# EAGLE schematic DIP-HDMI-v1.0 (EAGLE 7.6.0)

## Sheet 1 of 3
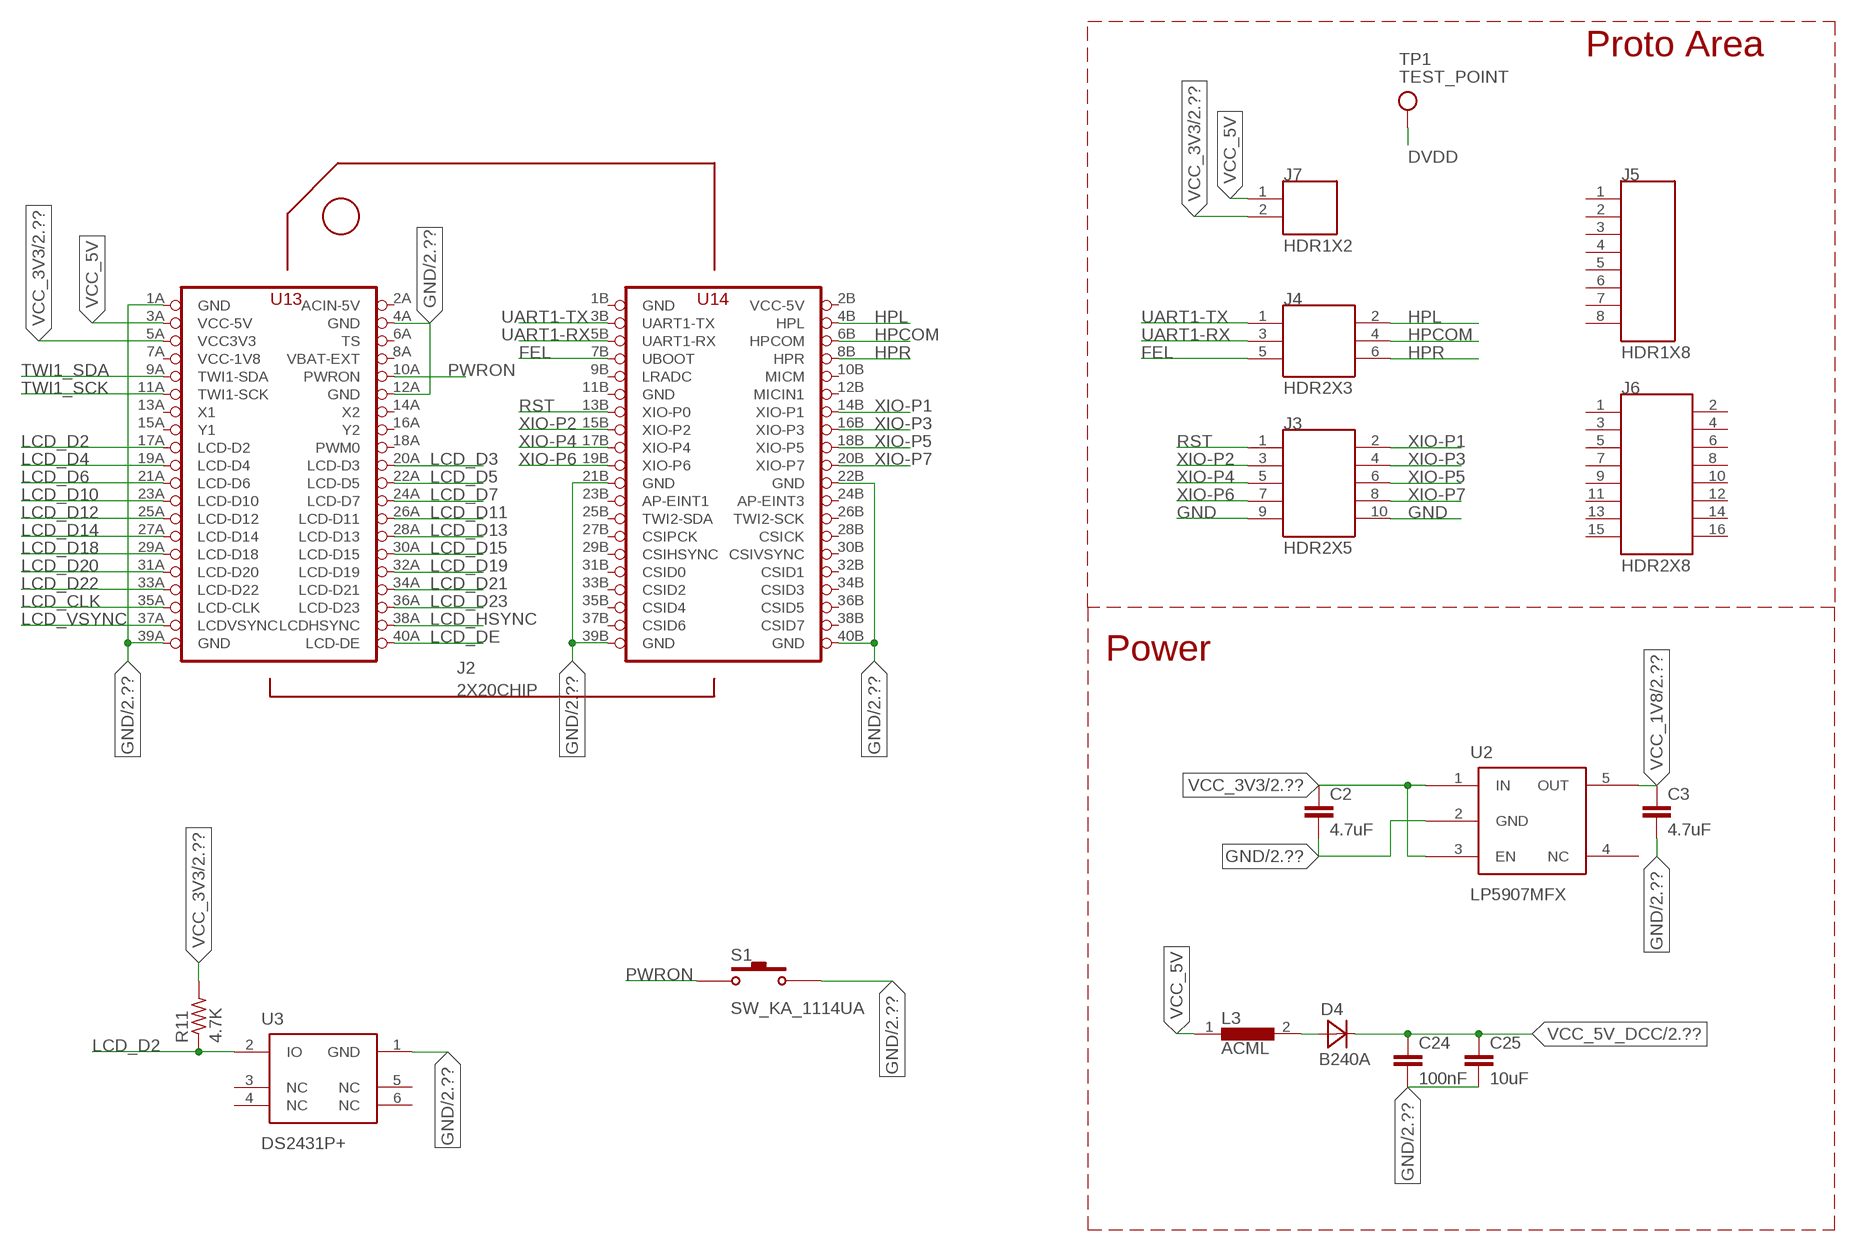
[diagram p0: schematic, sheet 1]

### Parts
C2  4.7uF  CAPACITOR  [1608_0603]
C3  4.7uF  CAPACITOR  [1608_0603]
C24  100nF  CAPACITOR  [1608_0603]
C25  10uF  CAPACITOR  [1608_0603]
D4  B240A  [SMA]
J2  2X20CHIP  [HDR2X2X20H]
J3  HDR2X5  [HDR2X5]
J4  HDR2X3  [HDR2X3]
J5  HDR1X8  [HDR1X8]
J6  HDR2X8  [HDR2X8]
J7  HDR1X2  [HDR1X2]
L3  ACML  [0603]
R11  4.7K  RESISTOR  [J1-0603]
S1  SW_KA_1114UA  [SW_KA_1114UA]
TP1  TEST_POINT  [TP-1MMX1MM]
U2  LP5907MFX  [SOT23-5]
U3  DS2431P+  [DS2431P+T&R]

### Nets
DVDD: TP1.0 ; also sheet 2
FEL: J2.7B(UBOOT) J4.5
GND: C2.2 C3.2 C24.2 C25.2 J2.1A(GND) J2.4A(GND) J2.12A(GND) J2.21B(GND) J2.22B(GND) J2.39A(GND) J2.39B(GND) J2.40B(GND) J3.9 J3.10 S1.3 S1.4 U2.2(GND) U3.1(GND) ; also sheet 2,3
HPCOM: J2.6B(HPCOM) J4.4
HPL: J2.4B(HPL) J4.2
HPR: J2.8B(HPR) J4.6
LCD_CLK: J2.35A(LCD-CLK) ; also sheet 2
LCD_D2: J2.17A(LCD-D2) R11.1 U3.2(IO)
LCD_D3: J2.20A(LCD-D3) ; also sheet 2
LCD_D4: J2.19A(LCD-D4) ; also sheet 2
LCD_D5: J2.22A(LCD-D5) ; also sheet 2
LCD_D6: J2.21A(LCD-D6) ; also sheet 2
LCD_D7: J2.24A(LCD-D7) ; also sheet 2
LCD_D10: J2.23A(LCD-D10) ; also sheet 2
LCD_D11: J2.26A(LCD-D11) ; also sheet 2
LCD_D12: J2.25A(LCD-D12) ; also sheet 2
LCD_D13: J2.28A(LCD-D13) ; also sheet 2
LCD_D14: J2.27A(LCD-D14) ; also sheet 2
LCD_D15: J2.30A(LCD-D15) ; also sheet 2
LCD_D18: J2.29A(LCD-D18) ; also sheet 2
LCD_D19: J2.32A(LCD-D19) ; also sheet 2
LCD_D20: J2.31A(LCD-D20) ; also sheet 2
LCD_D21: J2.34A(LCD-D21) ; also sheet 2
LCD_D22: J2.33A(LCD-D22) ; also sheet 2
LCD_D23: J2.36A(LCD-D23) ; also sheet 2
LCD_DE: J2.40A(LCD-DE) ; also sheet 2
LCD_HSYNC: J2.38A(LCDHSYNC) ; also sheet 2
LCD_VSYNC: J2.37A(LCDVSYNC) ; also sheet 2
N$7: D4.1(A) L3.2
PWRON: J2.10A(PWRON) S1.1 S1.2
RST: J2.13B(XIO-P0) J3.1 ; also sheet 2
TWI1_SCK: J2.11A(TWI1-SCK) ; also sheet 2,3
TWI1_SDA: J2.9A(TWI1-SDA) ; also sheet 2,3
UART1-RX: J2.5B(UART1-RX) J4.3
UART1-TX: J2.3B(UART1-TX) J4.1
VCC_1V8: C3.1 U2.5(OUT) ; also sheet 2
VCC_3V3: C2.1 J2.5A(VCC3V3) J7.2 R11.2 U2.1(IN) U2.3(EN) ; also sheet 2
VCC_5V: J2.3A(VCC-5V) J7.1 L3.1
VCC_5V_DCC: C24.1 C25.1 D4.2(C) ; also sheet 2,3
XIO-P1: J2.14B(XIO-P1) J3.2
XIO-P2: J2.15B(XIO-P2) J3.3
XIO-P3: J2.16B(XIO-P3) J3.4
XIO-P4: J2.17B(XIO-P4) J3.5
XIO-P5: J2.18B(XIO-P5) J3.6
XIO-P6: J2.19B(XIO-P6) J3.7
XIO-P7: J2.20B(XIO-P7) J3.8
Unconnected: J2.2A(ACIN-5V) J2.6A(TS) J2.8A(VBAT-EXT) J2.9B(LRADC) J2.10B(MICM) J2.12B(MICIN1) J2.13A(X1) J2.14A(X2) J2.15A(Y1) J2.16A(Y2) J2.18A(PWM0) J2.23B(AP-EINT1) J2.24B(AP-EINT3) J2.25B(TWI2-SDA) J2.26B(TWI2-SCK) J2.27B(CSIPCK) J2.28B(CSICK) J2.29B(CSIHSYNC) J2.30B(CSIVSYNC) J2.31B(CSID0) J2.32B(CSID1) J2.33B(CSID2) J2.34B(CSID3) J2.35B(CSID4) J2.36B(CSID5) J2.37B(CSID6) J2.38B(CSID7) J5.1 J5.2 J5.3 J5.4 J5.5 J5.6 J5.7 J5.8 J6.1 J6.2 J6.3 J6.4 J6.5 J6.6 J6.7 J6.8 J6.9 J6.10 J6.11 J6.12 J6.13 J6.14 J6.15 J6.16 U2.4(NC) U3.3(NC) U3.4(NC) U3.5(NC) U3.6(NC)

### Notes on the sheet
- Proto Area
- Power

## Sheet 2 of 3
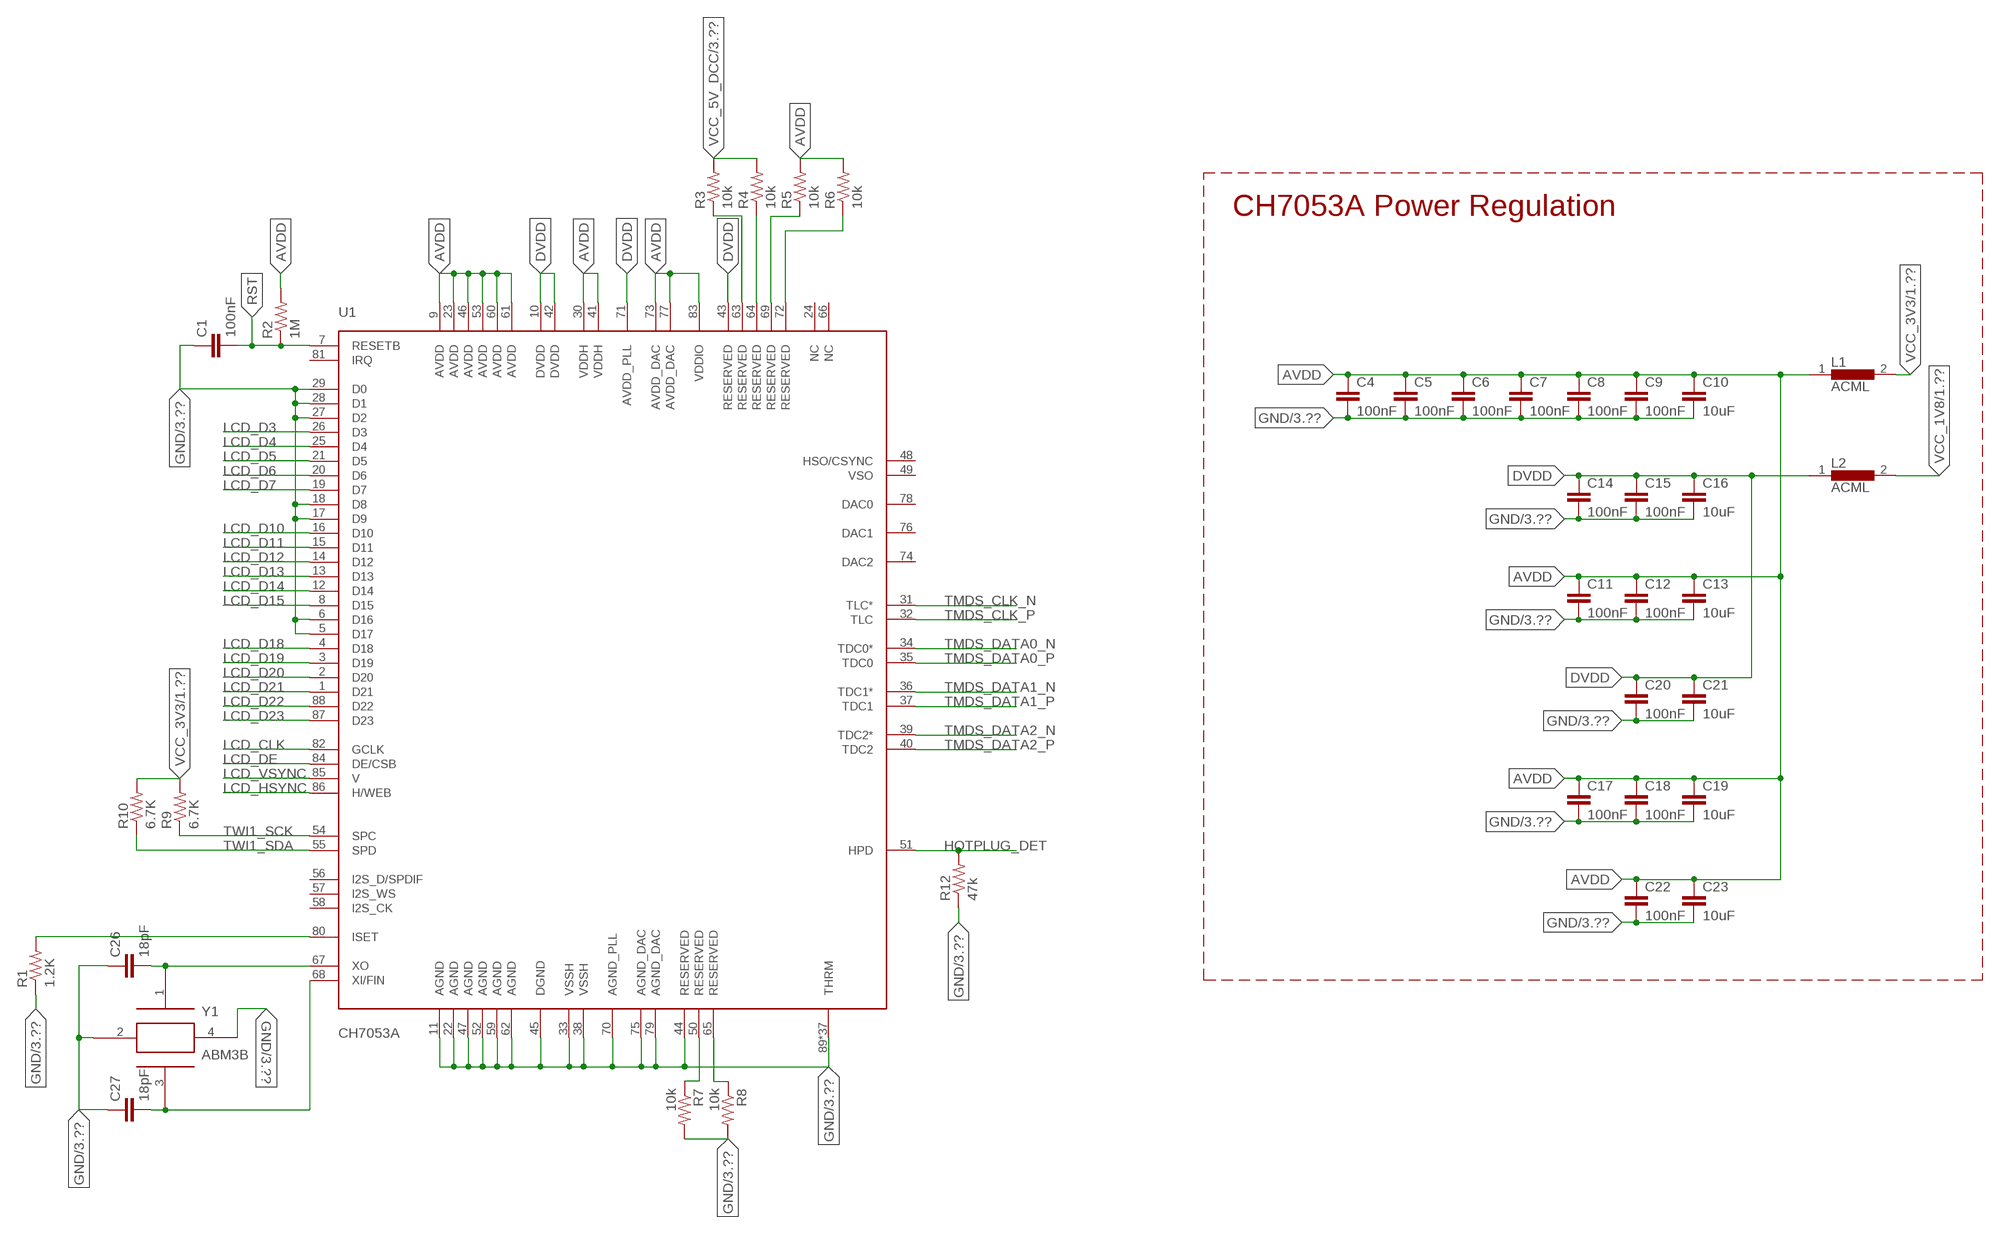
[diagram p1: schematic, sheet 2]

### Parts
C1  100nF  CAPACITOR  [1608_0603]
C4  100nF  CAPACITOR  [1608_0603]
C5  100nF  CAPACITOR  [1608_0603]
C6  100nF  CAPACITOR  [1608_0603]
C7  100nF  CAPACITOR  [1608_0603]
C8  100nF  CAPACITOR  [1608_0603]
C9  100nF  CAPACITOR  [1608_0603]
C10  10uF  CAPACITOR  [1608_0603]
C11  100nF  CAPACITOR  [1608_0603]
C12  100nF  CAPACITOR  [1608_0603]
C13  10uF  CAPACITOR  [1608_0603]
C14  100nF  CAPACITOR  [1608_0603]
C15  100nF  CAPACITOR  [1608_0603]
C16  10uF  CAPACITOR  [1608_0603]
C17  100nF  CAPACITOR  [1608_0603]
C18  100nF  CAPACITOR  [1608_0603]
C19  10uF  CAPACITOR  [1608_0603]
C20  100nF  CAPACITOR  [1608_0603]
C21  10uF  CAPACITOR  [1608_0603]
C22  100nF  CAPACITOR  [1608_0603]
C23  10uF  CAPACITOR  [1608_0603]
C26  18pF  CAPACITOR  [1608_0603]
C27  18pF  CAPACITOR  [1608_0603]
L1  ACML  [0603]
L2  ACML  [0603]
R1  1.2K  RESISTOR  [J1-0603]
R2  1M  RESISTOR  [J1-0603]
R3  10k  RESISTOR  [J1-0603]
R4  10k  RESISTOR  [J1-0603]
R5  10k  RESISTOR  [J1-0603]
R6  10k  RESISTOR  [J1-0603]
R7  10k  RESISTOR  [J1-0603]
R8  10k  RESISTOR  [J1-0603]
R9  6.7K  RESISTOR  [J1-0603]
R10  6.7K  RESISTOR  [J1-0603]
R12  47k  RESISTOR  [J1-0603]
U1  CH7053A  [QFN40P1000X1000X90_HS-89M]
Y1  ABM3B  [ABM3B]

### Nets
AVDD: C4.1 C5.1 C6.1 C7.1 C8.1 C9.1 C10.1 C11.1 C12.1 C13.1 C17.1 C18.1 C19.1 C22.1 C23.1 L1.1 R2.2 R5.2 R6.2 U1.9(AVDD) U1.23(AVDD) U1.30(VDDH) U1.41(VDDH) U1.46(AVDD) U1.53(AVDD) U1.60(AVDD) U1.61(AVDD) U1.73(AVDD_DAC) U1.77(AVDD_DAC) U1.83(VDDIO)
DVDD: C14.1 C15.1 C16.1 C20.1 C21.1 L2.1 U1.10(DVDD) U1.42(DVDD) U1.43(RESERVED) U1.71(AVDD_PLL) ; also sheet 1
GND: C1.1 C4.2 C5.2 C6.2 C7.2 C8.2 C9.2 C10.2 C11.2 C12.2 C13.2 C14.2 C15.2 C16.2 C17.2 C18.2 C19.2 C20.2 C21.2 C22.2 C23.2 C26.1 C27.1 R1.1 R7.2 R8.2 R12.1 U1.5(D17) U1.6(D16) U1.11(AGND) U1.17(D9) U1.18(D8) U1.22(AGND) U1.27(D2) U1.28(D1) U1.29(D0) U1.33(VSSH) U1.38(VSSH) U1.44(RESERVED) U1.45(DGND) U1.47(AGND) U1.52(AGND) U1.59(AGND) U1.62(AGND) U1.70(AGND_PLL) U1.75(AGND_DAC) U1.79(AGND_DAC) U1.89(THRM) U1.P$1(THRM) U1.P$2(THRM) U1.P$3(THRM) U1.P$4(THRM) U1.P$5(THRM) U1.P$6(THRM) U1.P$7(THRM) U1.P$8(THRM) U1.P$9(THRM) U1.P$10(THRM) U1.P$11(THRM) U1.P$12(THRM) U1.P$13(THRM) U1.P$14(THRM) U1.P$15(THRM) U1.P$16(THRM) U1.P$17(THRM) U1.P$18(THRM) U1.P$19(THRM) U1.P$20(THRM) U1.P$21(THRM) U1.P$22(THRM) U1.P$23(THRM) U1.P$24(THRM) U1.P$25(THRM) U1.P$26(THRM) U1.P$27(THRM) U1.P$28(THRM) U1.P$29(THRM) U1.P$30(THRM) U1.P$31(THRM) U1.P$32(THRM) U1.P$33(THRM) U1.P$34(THRM) U1.P$35(THRM) U1.P$36(THRM) Y1.2 Y1.4 ; also sheet 1,3
HOTPLUG_DET: R12.2 U1.51(HPD) ; also sheet 3
LCD_CLK: U1.82(GCLK) ; also sheet 1
LCD_D3: U1.26(D3) ; also sheet 1
LCD_D4: U1.25(D4) ; also sheet 1
LCD_D5: U1.21(D5) ; also sheet 1
LCD_D6: U1.20(D6) ; also sheet 1
LCD_D7: U1.19(D7) ; also sheet 1
LCD_D10: U1.16(D10) ; also sheet 1
LCD_D11: U1.15(D11) ; also sheet 1
LCD_D12: U1.14(D12) ; also sheet 1
LCD_D13: U1.13(D13) ; also sheet 1
LCD_D14: U1.12(D14) ; also sheet 1
LCD_D15: U1.8(D15) ; also sheet 1
LCD_D18: U1.4(D18) ; also sheet 1
LCD_D19: U1.3(D19) ; also sheet 1
LCD_D20: U1.2(D20) ; also sheet 1
LCD_D21: U1.1(D21) ; also sheet 1
LCD_D22: U1.88(D22) ; also sheet 1
LCD_D23: U1.87(D23) ; also sheet 1
LCD_DE: U1.84(DE/CSB) ; also sheet 1
LCD_HSYNC: U1.86(H/WEB) ; also sheet 1
LCD_VSYNC: U1.85(V) ; also sheet 1
N$1: C26.2 U1.67(XO) Y1.1
N$2: C27.2 U1.68(XI/FIN) Y1.3
N$3: R1.2 U1.80(ISET)
N$4: R7.1 U1.50(RESERVED)
N$5: R8.1 U1.65(RESERVED)
N$6: R5.1 U1.69(RESERVED)
N$17: R3.1 U1.63(RESERVED)
N$18: R4.1 U1.64(RESERVED)
N$20: R6.1 U1.72(RESERVED)
RST: C1.2 R2.1 U1.7(RESETB) ; also sheet 1
TMDS_CLK_N: U1.31(TLC*) ; also sheet 3
TMDS_CLK_P: U1.32(TLC) ; also sheet 3
TMDS_DATA0_N: U1.34(TDC0*) ; also sheet 3
TMDS_DATA0_P: U1.35(TDC0) ; also sheet 3
TMDS_DATA1_N: U1.36(TDC1*) ; also sheet 3
TMDS_DATA1_P: U1.37(TDC1) ; also sheet 3
TMDS_DATA2_N: U1.39(TDC2*) ; also sheet 3
TMDS_DATA2_P: U1.40(TDC2) ; also sheet 3
TWI1_SCK: R9.1 U1.54(SPC) ; also sheet 1,3
TWI1_SDA: R10.1 U1.55(SPD) ; also sheet 1,3
VCC_1V8: L2.2 ; also sheet 1
VCC_3V3: L1.2 R9.2 R10.2 ; also sheet 1
VCC_5V_DCC: R3.2 R4.2 ; also sheet 1,3
Unconnected: U1.24(NC) U1.48(HSO/CSYNC) U1.49(VSO) U1.56(I2S_D/SPDIF) U1.57(I2S_WS) U1.58(I2S_CK) U1.66(NC) U1.74(DAC2) U1.76(DAC1) U1.78(DAC0) U1.81(IRQ)

### Notes on the sheet
- CH7053A Power Regulation

## Sheet 3 of 3
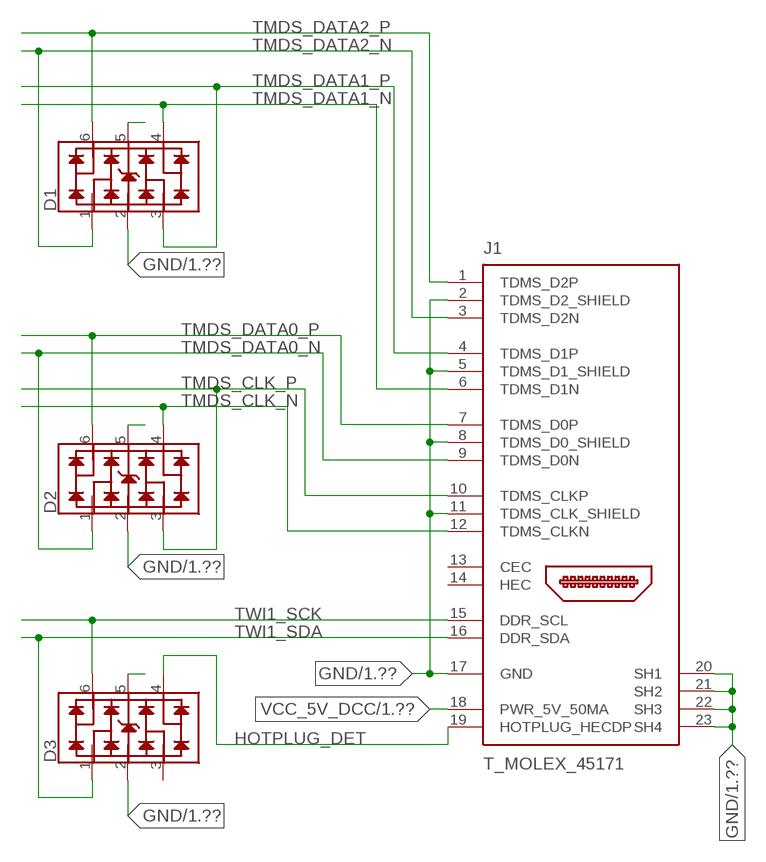
[diagram p2: schematic, sheet 3]

### Parts
D1  D-SEMTECH-RCLAMP0504S  [T_SOT95P285X90-6N]
D2  D-SEMTECH-RCLAMP0504S  [T_SOT95P285X90-6N]
D3  D-SEMTECH-RCLAMP0504S  [T_SOT95P285X90-6N]
J1  T_MOLEX_45171  [T_MOLEX_45171]

### Nets
GND: D1.2 D2.2 D3.2 J1.2(TDMS_D2_SHIELD) J1.5(TDMS_D1_SHIELD) J1.8(TDMS_D0_SHIELD) J1.11(TDMS_CLK_SHIELD) J1.17(GND) J1.20(SH1) J1.21(SH2) J1.22(SH3) J1.23(SH4) ; also sheet 1,2
HOTPLUG_DET: D3.4 J1.19(HOTPLUG_HECDP) ; also sheet 2
N$8: D1.5
N$9: D2.5
N$10: D3.5
TMDS_CLK_N: D2.4 J1.12(TDMS_CLKN) ; also sheet 2
TMDS_CLK_P: D2.3 J1.10(TDMS_CLKP) ; also sheet 2
TMDS_DATA0_N: D2.1 J1.9(TDMS_D0N) ; also sheet 2
TMDS_DATA0_P: D2.6 J1.7(TDMS_D0P) ; also sheet 2
TMDS_DATA1_N: D1.4 J1.6(TDMS_D1N) ; also sheet 2
TMDS_DATA1_P: D1.3 J1.4(TDMS_D1P) ; also sheet 2
TMDS_DATA2_N: D1.1 J1.3(TDMS_D2N) ; also sheet 2
TMDS_DATA2_P: D1.6 J1.1(TDMS_D2P) ; also sheet 2
TWI1_SCK: D3.6 J1.15(DDR_SCL) ; also sheet 1,2
TWI1_SDA: D3.1 J1.16(DDR_SDA) ; also sheet 1,2
VCC_5V_DCC: J1.18(PWR_5V_50MA) ; also sheet 1,2
Unconnected: D3.3 J1.13(CEC) J1.14(HEC)

## Power pins joined to a net without a drawn wire
GND: J2.1B(GND) J2.11B(GND)
VCC-1V8: J2.7A(VCC-1V8)
VCC-5V: J2.2B(VCC-5V)

## Library data of the parts
C1-C27 = CHIP_HDMI:CAPACITOR
D1-D3 = CHIP_HDMI:D-SEMTECH-RCLAMP0504S
D4 = CHIP_HDMI:B240A
J1 = CHIP_HDMI:T_MOLEX_45171
J2 = CHIP_HDMI:2X20CHIP
J3 = CHIP_HDMI:HDR2X5
J4 = CHIP_HDMI:HDR2X3
J5 = CHIP_HDMI:HDR1X8
J6 = CHIP_HDMI:HDR2X8
J7 = CHIP_HDMI:HDR1X2
L1-L3 = CHIP_HDMI:ACML
R1-R12 = CHIP_HDMI:RESISTOR
S1 = CHIP_HDMI:SW_KA_1114UA
TP1 = CHIP_HDMI:TEST_POINT
U1 = CHIP_HDMI:CH7053A
U2 = CHIP_HDMI:LP5907MFX
U3 = CHIP_HDMI:DS2431P+
Y1 = CHIP_HDMI:ABM3B